# EAGLE design ECG_Charger (EAGLE 6.4)
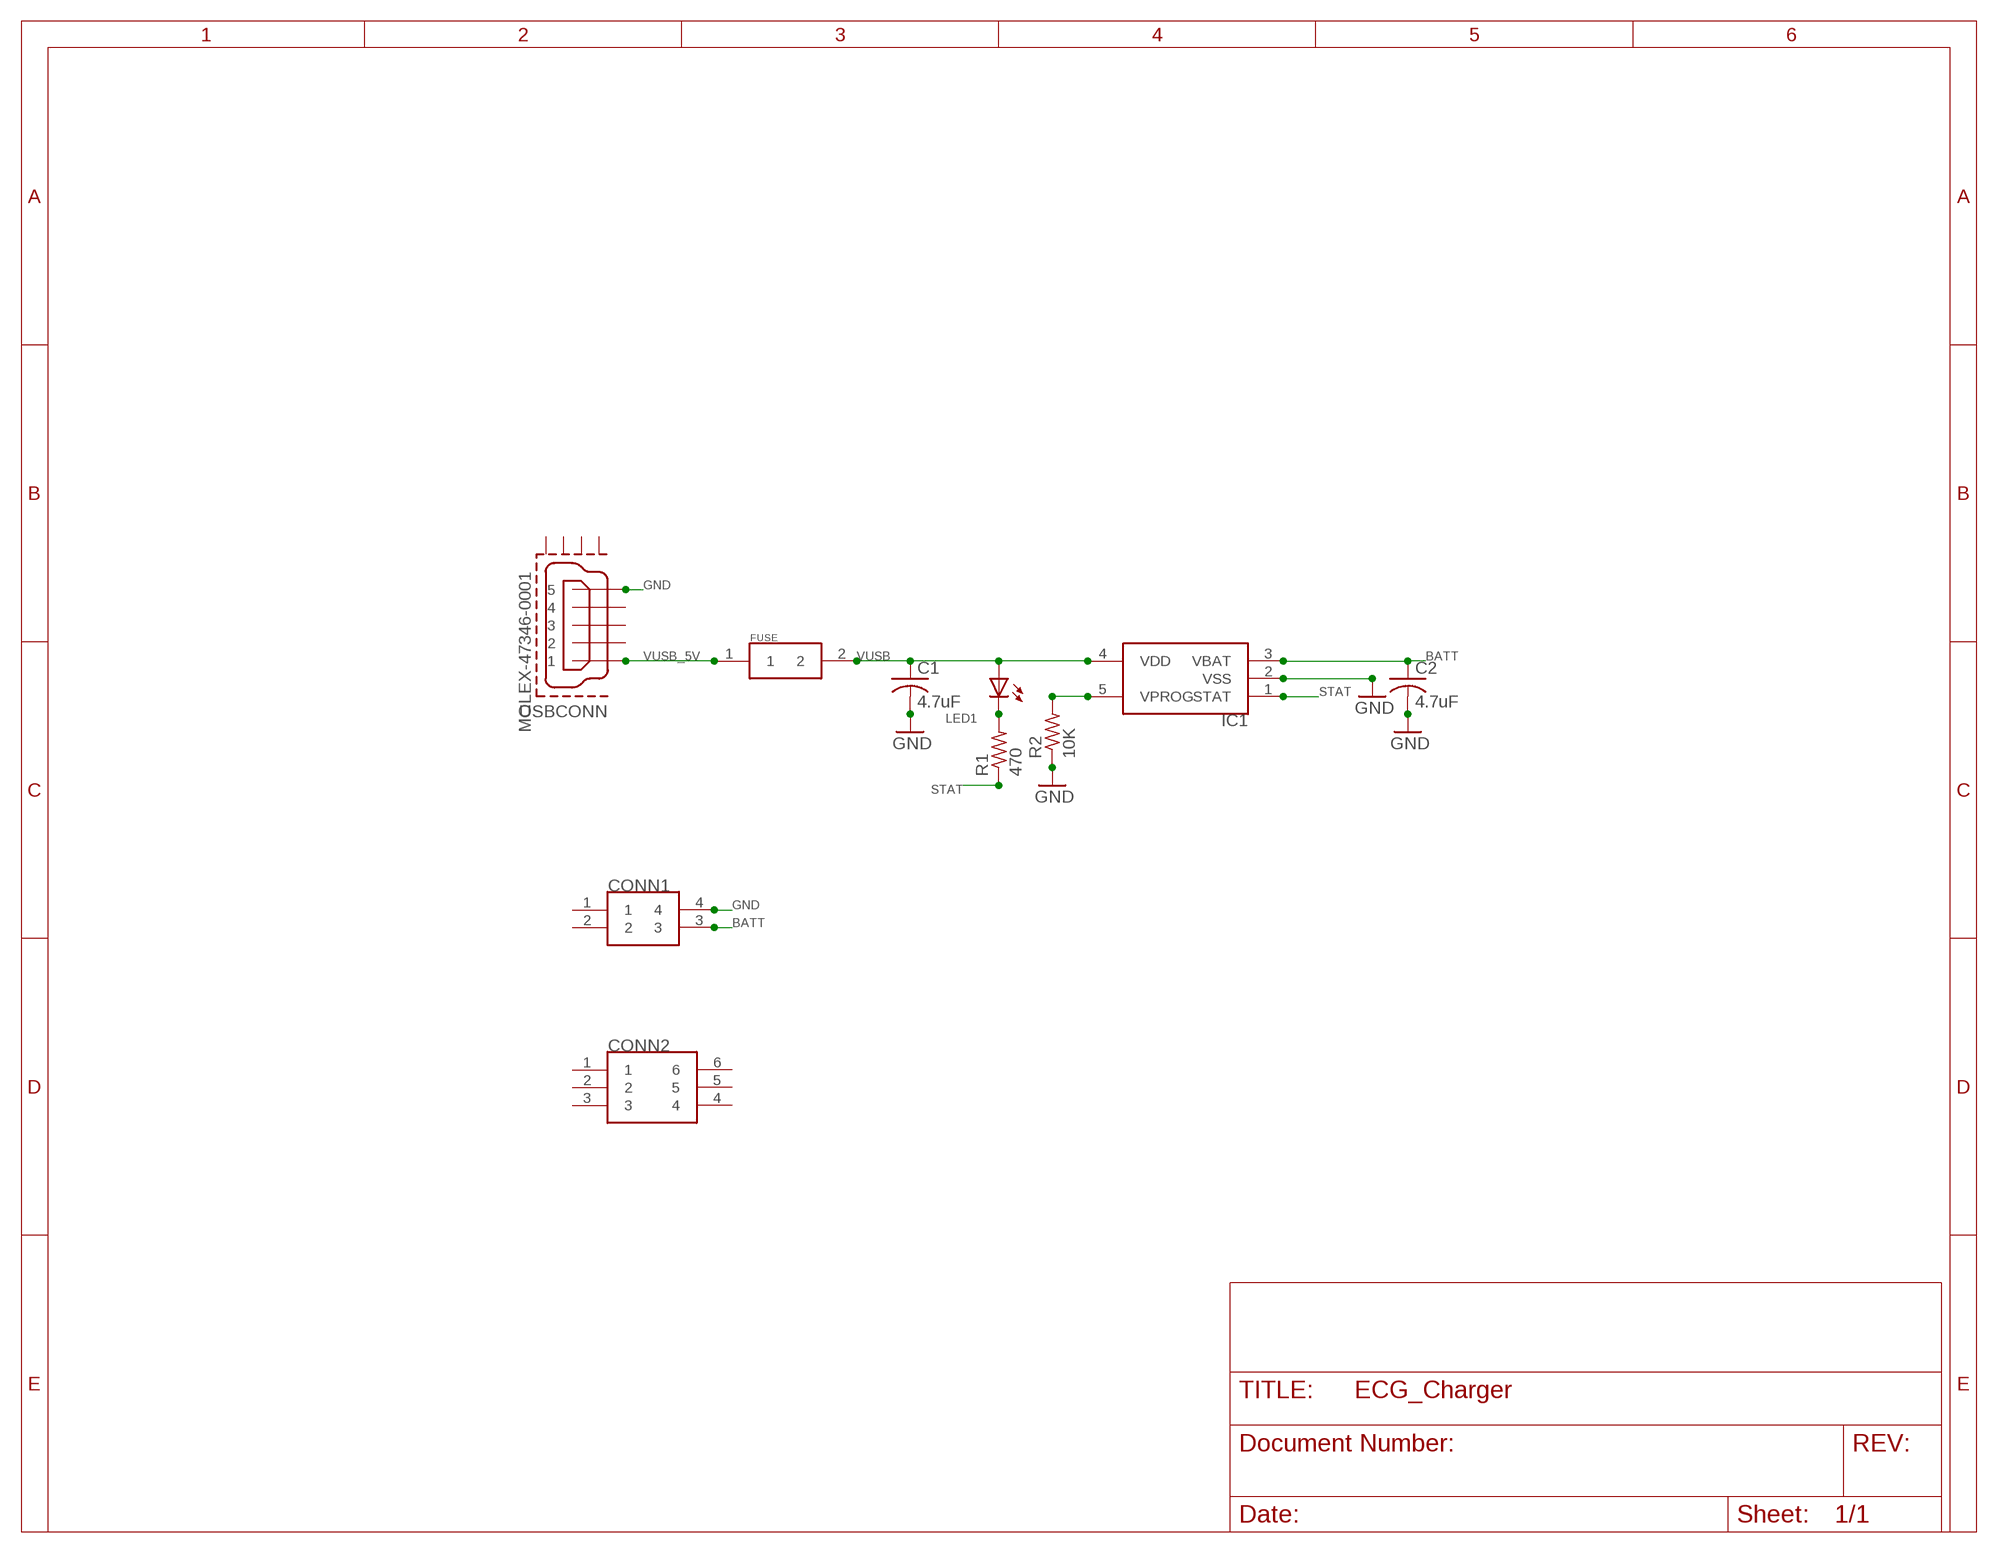
[diagram p0: schematic, sheet 1]

## Parts
C1  4.7uF  C-USC0805  [C0805]
C2  4.7uF  C-USC0805  [C0805]
CONN1  M80-4V  [M80-4-V]
CONN2  M80-6V  [M80-6-V]
FUSE  FUSE-MF_SERIES  [1206]
IC1  MCP73832_SOT23-5  [SOT23-5]
LED1  LED_SMT_0805  [SMT_LED_0805]
R1  470  R-US_R0805  [R0805]
R2  10K  R-US_R0805  [R0805]
USBCONN  MOLEX-47346-0001  [MOLEX-47364-0001]

## Nets
BATT: C2.1 CONN1.3 IC1.3(VBAT)
GND: C1.2 C2.2 CONN1.4 IC1.2(VSS) R2.1 USBCONN.5
N$3: LED1.C R1.2
STAT: IC1.1(STAT) R1.1
VPROG: IC1.5(VPROG) R2.2
VUSB: C1.1 FUSE.2 IC1.4(VDD) LED1.A
VUSB_5V: FUSE.1 USBCONN.1
Unconnected: CONN1.1 CONN1.2 CONN2.1 CONN2.2 CONN2.3 CONN2.4 CONN2.5 CONN2.6 USBCONN.2 USBCONN.3 USBCONN.4 USBCONN.GND1 USBCONN.GND2 USBCONN.GND3 USBCONN.GND4

## Library data of the parts
C1 C2 = rcl:C-US: CAPACITOR, American symbol
CONN1 = harwin:M80-4
CONN2 = harwin:M80-6
FUSE = bourns-fuse:FUSE-MF_SERIES
IC1 = KomodoOpenLab:MCP73832_SOT23-5
LED1 = LITEON:LED_SMT_0805
R1 R2 = rcl:R-US_: RESISTOR, American symbol
USBCONN = usb_con-update:MOLEX-47346-0001: MICRO USB B, BOTTOM MOUNT

## Board
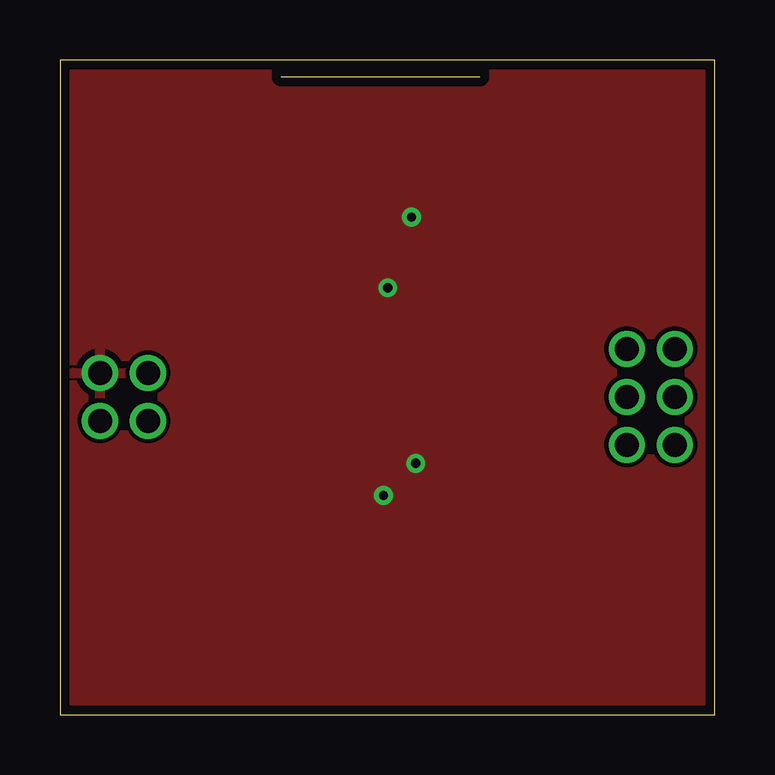
[diagram p1: board, top side]
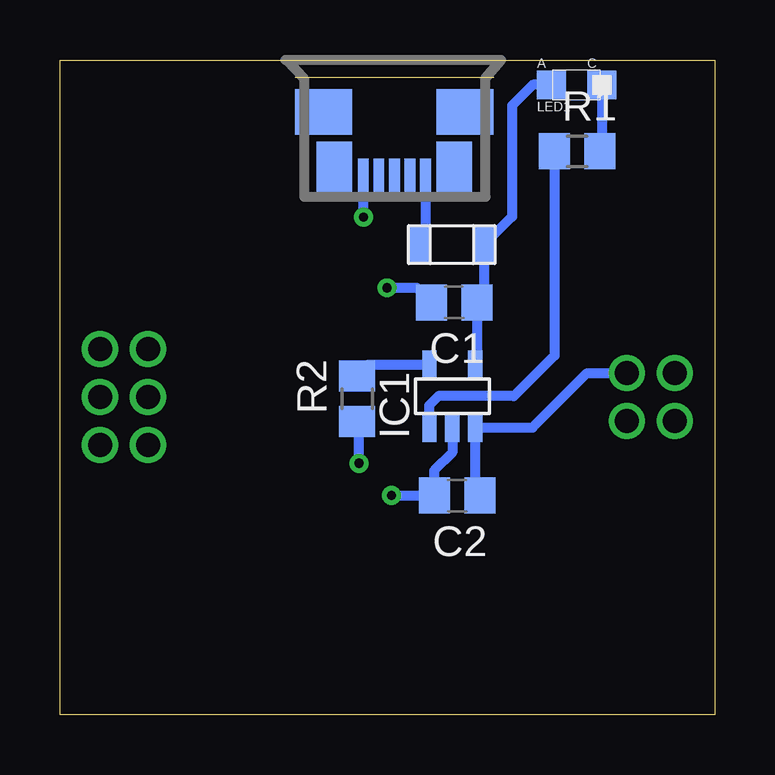
[diagram p2: board, bottom side, seen from below]

Size 27.3 x 27.3 mm. Coordinates in mm from the lower left corner, seen from the top.
Outline: 0,0 27.3,0 27.3,27.3 0,27.3 0,0
Copper layers (1*2+15*16): Top 0.035mm / dielectric 0.5mm / Route2 0.035mm / dielectric 0.5mm / Route15 0.035mm / dielectric 0.5mm / Bottom 0.035mm
Design rules "advanced_circuits": minimum track width 7mil, minimum drill 15mil, track to track 7mil, track to pad 7mil, pad to pad 7mil, via to via 7mil, smd to smd 7mil, copper to edge 15mil, drill to drill 8mil, minimum pad ring 10mil, minimum via ring 8mil, stop-mask expansion 5mil, vias tented up to drill 0mil, thermal gap 10mil

### Footprints (pad centres in the part's own frame; a part is rotated, then mirrored left to right if it is on the bottom)
C0805 = smd 1.3 x 1.5: 1 -0.95,0; 2 0.95,0
M80-4-V = drill 1: 1 -1,-1; 2 1,-1; 3 1,1; 4 -1,1
M80-6-V = drill 1: 1 -2,-1; 2 0,-1; 3 2,-1; 4 2,1; 5 0,1; 6 -2,1
1206 = smd 0.9 x 1.6: 1 -1.35,0; 2 1.35,0
SOT23-5 = smd 0.6 x 1.2: 1 -0.95,-1.306; 2 0,-1.306; 3 0.95,-1.306; 4 0.95,1.306; 5 -0.95,1.306
SMT_LED_0805 = smd 1.2 x 1.2: A -1,0; C 1.1,0
R0805 = smd 1.3 x 1.5: 1 -0.95,0; 2 0.95,0
MOLEX-47364-0001 = smd 1.7 x 0.45: 1 2.8,1.3; 2 2.8,0.65; 3 2.8,0; 4 2.8,-0.65; 5 2.8,-1.3 | smd 1.9 x 2.375: GND1 0,2.95; GND4 0,-2.95 | smd 2.1 x 1.475: GND2 2.3,2.5; GND3 2.3,-2.5

### Placement (x,y rotation side)
C1  10.87,17.2 180 bottom
C2  10.74,9.14 180 bottom
CONN1  2.67,13.26 0 top
CONN2  24.64,13.26 90 top
FUSE  10.97,19.61 0 bottom
IC1  10.95,13.28 0 bottom
LED1  5.82,26.26 0 bottom
R1  5.74,23.5 0 bottom
R2  14.91,13.18 90 bottom
USBCONN  13.36,25.15 270 bottom

### Tracks (layer width: path | path; a pad name or v marks a point on that pad's centre or on a via)
BATT
  Bottom 0.406: C2.1 10,9.35 IC1.3 7.61,11.98 5.33,14.25 CONN1.3
GND  (via drill 0.38)
  Bottom 0.406: USBCONN.5 v14.66,20.76 v14.66,20.75 | v13.66,17.8 12.43,17.8 C1.2 | v14.83,10.49 14.83,12.16 R2.1 | v13.49,9.14 C2.2 11.71,9.16 11.71,10.19 10.95,10.95 IC1.2
  pour Top: 0.25,26.92 26.92,26.92 26.92,0.25 0.25,0.25
N$3
  Bottom 0.406: LED1.C 4.72,23.57 R1.2
STAT
  Bottom 0.406: R1.1 6.69,14.98 8.38,13.28 11.53,13.28 11.91,12.9 11.91,11.99 IC1.1
VPROG
  Bottom 0.406: IC1.5 14.45,14.59 R2.2
VUSB
  Bottom 0.406: LED1.A 7.59,26.26 8.46,25.4 8.46,20.77 FUSE.2 9.62,17.49 C1.1 9.92,14.67 IC1.4
VUSB_5V
  Bottom 0.406: USBCONN.1 12.06,19.87 FUSE.1